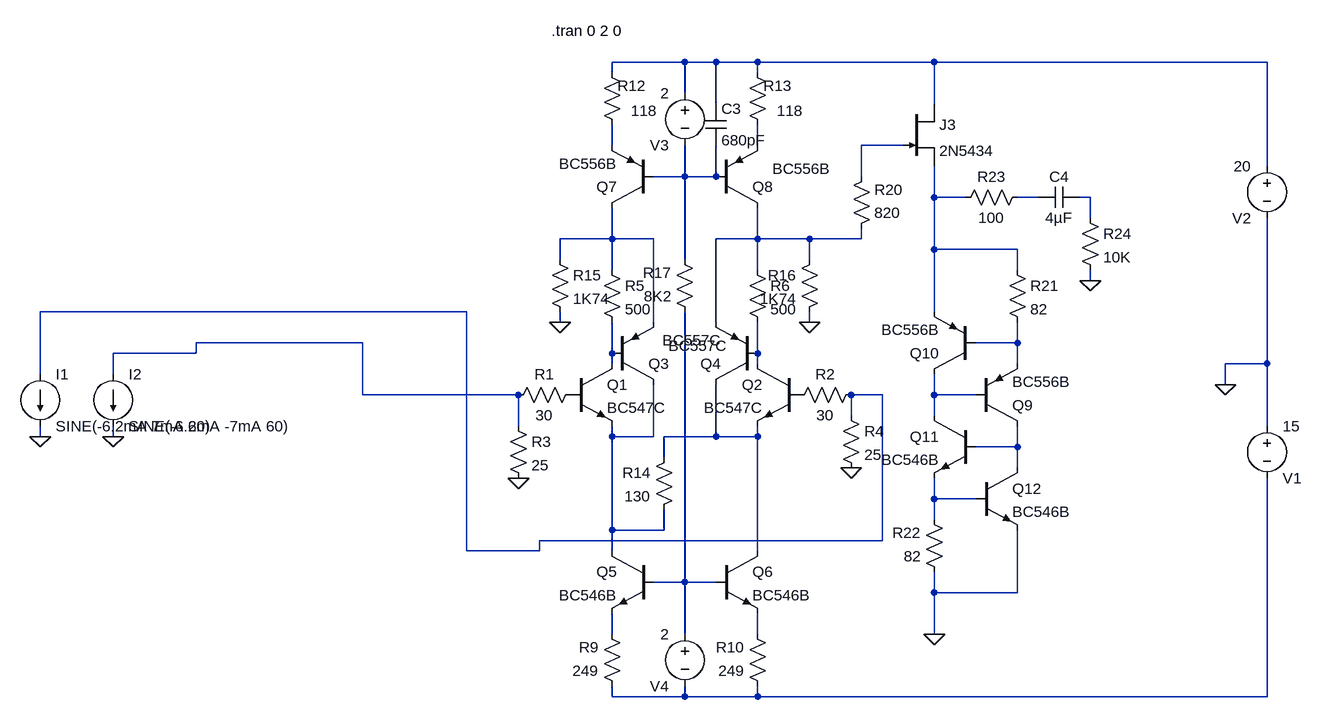
[diagram p0: schematic Draft1.asc]
Draft1.asc, the LTspice schematic file:
Version 4
SHEET 1 1452 916
WIRE 496 -208 384 -208
WIRE 544 -208 496 -208
WIRE 608 -208 544 -208
WIRE 880 -208 608 -208
WIRE 1392 -208 880 -208
WIRE 384 -192 384 -208
WIRE 608 -192 608 -208
WIRE 496 -160 496 -208
WIRE 544 -144 544 -208
WIRE 880 -144 880 -208
WIRE 384 -80 384 -112
WIRE 608 -80 608 -112
WIRE 832 -80 768 -80
WIRE 1392 -48 1392 -208
WIRE 496 -32 496 -80
WIRE 496 -32 448 -32
WIRE 544 -32 544 -80
WIRE 544 -32 496 -32
WIRE 768 -32 768 -80
WIRE 880 0 880 -48
WIRE 928 0 880 0
WIRE 1040 0 1008 0
WIRE 1120 0 1104 0
WIRE 1120 32 1120 0
WIRE 384 64 384 16
WIRE 384 64 304 64
WIRE 448 64 384 64
WIRE 608 64 608 16
WIRE 608 64 544 64
WIRE 688 64 608 64
WIRE 768 64 768 48
WIRE 768 64 688 64
WIRE 880 80 880 0
WIRE 1008 80 880 80
WIRE 304 96 304 64
WIRE 496 96 496 -32
WIRE 688 96 688 64
WIRE 384 112 384 64
WIRE 608 112 608 64
WIRE 1008 112 1008 80
WIRE 1120 128 1120 112
WIRE 160 176 -496 176
WIRE 880 176 880 80
WIRE 304 192 304 176
WIRE 448 192 448 64
WIRE 544 192 544 64
WIRE 688 192 688 176
WIRE 0 224 -256 224
WIRE 1008 224 1008 192
WIRE 1008 224 944 224
WIRE -256 240 -256 224
WIRE -256 240 -384 240
WIRE 384 240 384 192
WIRE 608 240 608 192
WIRE 384 256 384 240
WIRE 608 256 608 240
WIRE 1008 256 1008 224
WIRE 1392 256 1392 32
WIRE 1392 256 1328 256
WIRE -496 272 -496 176
WIRE -384 272 -384 240
WIRE 1328 288 1328 256
WIRE 0 304 0 224
WIRE 240 304 0 304
WIRE 800 304 752 304
WIRE 880 304 880 272
WIRE 944 304 880 304
WIRE 752 336 752 304
WIRE 880 336 880 304
WIRE 240 352 240 304
WIRE 1392 352 1392 256
WIRE -496 368 -496 352
WIRE -384 368 -384 352
WIRE 384 368 384 352
WIRE 448 368 448 288
WIRE 448 368 384 368
WIRE 544 368 544 288
WIRE 544 368 464 368
WIRE 608 368 608 352
WIRE 608 368 544 368
WIRE 1008 384 1008 352
WIRE 1008 384 944 384
WIRE 464 400 464 368
WIRE 1008 416 1008 384
WIRE 880 464 880 432
WIRE 944 464 880 464
WIRE 880 496 880 464
WIRE 384 512 384 368
WIRE 464 512 464 480
WIRE 464 512 384 512
WIRE 800 528 800 304
WIRE 800 528 272 528
WIRE 160 544 160 176
WIRE 272 544 272 528
WIRE 272 544 160 544
WIRE 384 544 384 512
WIRE 608 544 608 368
WIRE 496 592 496 176
WIRE 496 592 448 592
WIRE 544 592 496 592
WIRE 880 608 880 576
WIRE 1008 608 1008 512
WIRE 1008 608 880 608
WIRE 384 672 384 640
WIRE 496 672 496 592
WIRE 608 672 608 640
WIRE 880 672 880 608
WIRE 384 768 384 752
WIRE 496 768 496 752
WIRE 496 768 384 768
WIRE 608 768 608 752
WIRE 608 768 496 768
WIRE 1392 768 1392 432
WIRE 1392 768 608 768
FLAG 1328 288 0
FLAG -496 368 0
FLAG -384 368 0
FLAG 304 192 0
FLAG 688 192 0
FLAG 1120 128 0
FLAG 880 672 0
FLAG 240 432 0
FLAG 752 416 0
SYMBOL voltage 1392 336 R0
WINDOW 0 24 96 Left 2
WINDOW 3 24 16 Left 2
WINDOW 123 0 0 Left 2
WINDOW 39 0 0 Left 2
SYMATTR InstName V1
SYMATTR Value 15
SYMBOL voltage 1392 -64 M0
WINDOW 0 24 96 Left 2
WINDOW 3 24 16 Left 2
WINDOW 123 0 0 Left 2
WINDOW 39 0 0 Left 2
SYMATTR InstName V2
SYMATTR Value 20
SYMBOL npn 448 544 M0
SYMATTR InstName Q5
SYMATTR Value BC546B
SYMBOL res 400 768 R180
WINDOW 0 36 76 Left 2
WINDOW 3 36 40 Left 2
SYMATTR InstName R9
SYMATTR Value 249
SYMBOL res 624 768 R180
WINDOW 0 36 76 Left 2
WINDOW 3 36 40 Left 2
SYMATTR InstName R10
SYMATTR Value 249
SYMBOL npn 544 544 R0
SYMATTR InstName Q6
SYMATTR Value BC546B
SYMBOL pnp 448 16 R180
SYMATTR InstName Q7
SYMATTR Value BC556B
SYMBOL pnp 544 16 M180
WINDOW 3 87 60 Left 2
SYMATTR Value BC556B
SYMATTR InstName Q8
SYMBOL res 400 -96 R180
WINDOW 0 -37 76 Left 2
WINDOW 3 -54 37 Left 2
SYMATTR InstName R12
SYMATTR Value 118
SYMBOL res 624 -96 R180
WINDOW 0 -37 76 Left 2
WINDOW 3 -54 37 Left 2
SYMATTR InstName R13
SYMATTR Value 118
SYMBOL res 480 384 M0
SYMATTR InstName R14
SYMATTR Value 130
SYMBOL res 288 80 R0
SYMATTR InstName R15
SYMATTR Value 1K74
SYMBOL res 704 80 M0
SYMATTR InstName R16
SYMATTR Value 1K74
SYMBOL res 512 192 R180
WINDOW 0 36 76 Left 2
WINDOW 3 36 40 Left 2
SYMATTR InstName R17
SYMATTR Value 8K2
SYMBOL cap 528 -144 R0
SYMATTR InstName C3
SYMATTR Value 680pF
SYMBOL njf 832 -144 R0
SYMATTR InstName J3
SYMATTR Value 2N5434
SYMBOL res 752 64 M180
WINDOW 0 36 76 Left 2
WINDOW 3 36 40 Left 2
SYMATTR InstName R20
SYMATTR Value 820
SYMBOL res 896 592 R180
WINDOW 0 36 76 Left 2
WINDOW 3 36 40 Left 2
SYMATTR InstName R22
SYMATTR Value 82
SYMBOL res 1024 -16 R90
WINDOW 0 0 56 VBottom 2
WINDOW 3 32 56 VTop 2
SYMATTR InstName R23
SYMATTR Value 100
SYMBOL cap 1104 -16 R90
WINDOW 0 0 32 VBottom 2
WINDOW 3 32 32 VTop 2
SYMATTR InstName C4
SYMATTR Value 4µF
SYMBOL res 1104 16 R0
SYMATTR InstName R24
SYMATTR Value 10K
SYMBOL npn 944 336 M0
SYMATTR InstName Q11
SYMATTR Value BC546B
SYMBOL npn 944 416 R0
SYMATTR InstName Q12
SYMATTR Value BC546B
SYMBOL res 992 96 R0
SYMATTR InstName R21
SYMATTR Value 82
SYMBOL pnp 944 352 M180
SYMATTR InstName Q9
SYMATTR Value BC556B
SYMBOL pnp 944 272 R180
SYMATTR InstName Q10
SYMATTR Value BC556B
SYMBOL current -496 272 R0
WINDOW 123 0 0 Left 2
WINDOW 39 0 0 Left 2
SYMATTR InstName I1
SYMATTR Value SINE(-6.2mA 7mA 60)
SYMBOL npn 320 256 R0
SYMATTR InstName Q1
SYMATTR Value BC547C
SYMBOL npn 672 256 M0
SYMATTR InstName Q2
SYMATTR Value BC547C
SYMBOL res 336 288 R90
WINDOW 0 0 56 VBottom 2
WINDOW 3 32 56 VTop 2
SYMATTR InstName R1
SYMATTR Value 30
SYMBOL res 768 288 R90
WINDOW 0 0 56 VBottom 2
WINDOW 3 32 56 VTop 2
SYMATTR InstName R2
SYMATTR Value 30
SYMBOL res 224 336 R0
SYMATTR InstName R3
SYMATTR Value 25
SYMBOL res 736 320 R0
SYMATTR InstName R4
SYMATTR Value 25
SYMBOL pnp 384 288 M180
WINDOW 3 87 60 Left 2
SYMATTR Value BC557C
SYMATTR InstName Q3
SYMBOL pnp 608 288 R180
SYMATTR InstName Q4
SYMATTR Value BC557C
SYMBOL res 368 96 R0
SYMATTR InstName R5
SYMATTR Value 500
SYMBOL res 592 96 R0
SYMATTR InstName R6
SYMATTR Value 500
SYMBOL voltage 496 -176 M0
WINDOW 0 24 96 Left 2
WINDOW 3 24 16 Left 2
WINDOW 123 0 0 Left 2
WINDOW 39 0 0 Left 2
SYMATTR InstName V3
SYMATTR Value 2
SYMBOL voltage 496 656 M0
WINDOW 0 24 96 Left 2
WINDOW 3 24 16 Left 2
WINDOW 123 0 0 Left 2
WINDOW 39 0 0 Left 2
SYMATTR InstName V4
SYMATTR Value 2
SYMBOL current -384 272 R0
WINDOW 123 0 0 Left 2
WINDOW 39 0 0 Left 2
SYMATTR InstName I2
SYMATTR Value SINE(-6.2mA -7mA 60)
TEXT 400 -256 Right 2 !.tran 0 2 0

The netlist it stands for:
* Draft1.asc
V1 0 N024 15
V2 N001 0 20
Q5 N017 N021 N022 0 BC546B
R9 N024 N022 249
R10 N024 N023 249
Q6 N018 N021 N023 0 BC546B
Q7 N009 N005 N002 0 BC556B
Q8 N010 N005 N003 0 BC556B
R12 N002 N001 118
R13 N003 N001 118
R14 N018 N017 130
R15 N009 0 1K74
R16 N010 0 1K74
R17 N021 N005 8K2
C3 N001 N005 680pF
J3 N001 N004 N006 2N5434
R20 N010 N004 820
R22 0 N020 82
R23 N007 N006 100
C4 N008 N007 4µF
R24 N008 0 10K
Q11 N016 N019 N020 0 BC546B
Q12 N019 N020 0 0 BC546B
R21 N006 N013 82
Q9 N019 N016 N013 0 BC556B
Q10 N016 N013 N006 0 BC556B
I1 N011 0 SINE(-6.2mA 7mA 60)
Q1 N014 P001 N017 0 BC547C
Q2 N015 P002 N018 0 BC547C
R1 P001 N012 30
R2 N011 P002 30
R3 N012 0 25
R4 N011 0 25
Q3 N017 N014 N009 0 BC557C
Q4 N018 N015 N010 0 BC557C
R5 N009 N014 500
R6 N010 N015 500
V3 N001 N005 2
V4 N021 N024 2
I2 N012 0 SINE(-6.2mA -7mA 60)
.model NPN NPN
.model PNP PNP
.lib standard.bjt
.model NJF NJF
.model PJF PJF
.lib standard.jft
.tran 0 2 0
.backanno
.end